# EAGLE design Powerswitch 2 Dioda dan MPU6050 v2  (EAGLE 9.6.2)
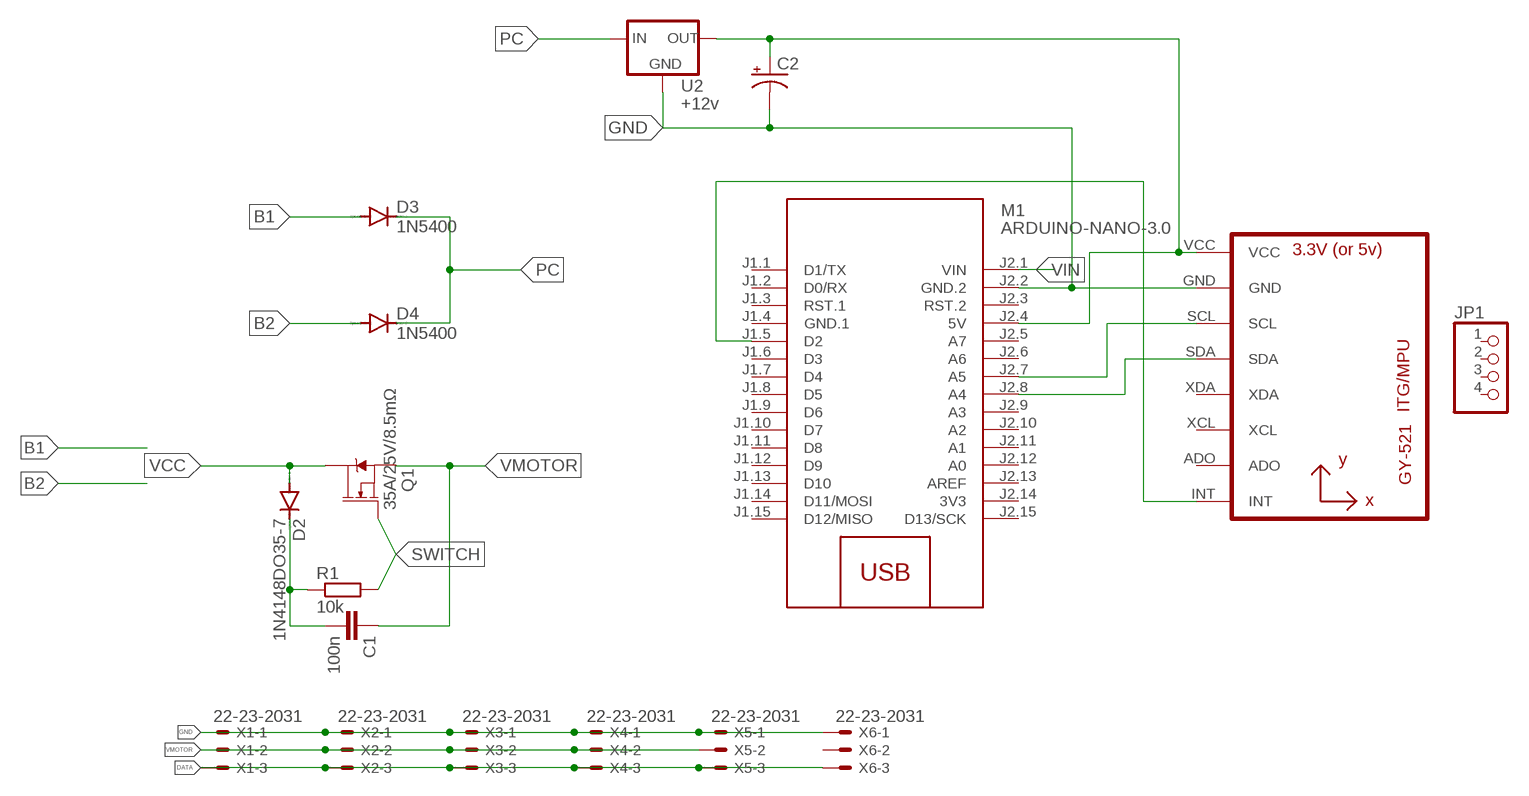
[diagram p0: schematic, sheet 1]

## Parts
C1  100n  C-EU025-030X050  [C025-030X050]
C2  CPOL-USE2-5  [E2-5]
D2  1N4148DO35-7  [DO35-7]
D3  1N5400  [DO201-15]
D4  1N5400  [DO201-15]
JP1  PINHD-1X4  [1X04]
M1  ARDUINO-NANO-3.0  [ARDUINO-NANO-3.0]
Q1  35A/25V/8.5mΩ  MOSFET-NCH-FDD8780  [DPAK]
R1  10k  R-EU_R1206  [R1206]
U1  GY-521MPU6050  [GY-521]
U2  +12v  V_REG_78XX7812  [TO-252]
X1  22-23-2031  [22-23-2031]
X2  22-23-2031  [22-23-2031]
X3  22-23-2031  [22-23-2031]
X4  22-23-2031  [22-23-2031]
X5  22-23-2031  [22-23-2031]
X6  22-23-2031  [22-23-2031]

## Nets
B1: D3.A
B2: D4.A
DATA: X1.3 X2.3 X3.3 X4.3 X5.3 X6.3
GND: C2.- M1.J2.2(GND.2) U1.GND U2.3(GND) X1.1 X2.1 X3.1 X4.1 X5.1 X6.1
N$4: M1.J2.8(A4) U1.SDA
N$5: C1.2 D2.C R1.1
N$6: M1.J2.7(A5) U1.SCL
N$9: M1.J1.5(D2) U1.INT
N$11: C2.+ M1.J2.4(5V) U1.VCC U2.2(OUT)
PC: D3.C D4.C U2.1(IN)
SWITCH: Q1.1(G) R1.2
VCC: D2.A Q1.4(D)
VIN: M1.J2.1(VIN)
VMOTOR: C1.1 Q1.3(S) X1.2 X2.2 X3.2 X4.2 X5.2
Unconnected: JP1.1 JP1.2 JP1.3 JP1.4 M1.J1.1(D1/TX) M1.J1.2(D0/RX) M1.J1.3(RST.1) M1.J1.6(D3) M1.J1.7(D4) M1.J1.8(D5) M1.J1.9(D6) M1.J1.10(D7) M1.J1.11(D8) M1.J1.12(D9) M1.J1.13(D10) M1.J1.14(D11/MOSI) M1.J1.15(D12/MISO) M1.J2.3(RST.2) M1.J2.5(A7) M1.J2.6(A6) M1.J2.9(A3) M1.J2.10(A2) M1.J2.11(A1) M1.J2.12(A0) M1.J2.13(AREF) M1.J2.15(D13/SCK) U1.ADO U1.XCL U1.XDA X6.2

## Power pins joined to a net without a drawn wire
3V3: M1.J2.14(3V3)
GND.1: M1.J1.4(GND.1)

## Library data of the parts
C1 = rcl:C-EU: CAPACITOR, European symbol; SPICEPREFIX: C
C2 = rcl:CPOL-US: POLARIZED CAPACITOR, American symbol; SPICEPREFIX: C
D2 = diode:1N4148: DIODE high speed (Philips)
D3 D4 = diode:1N5400: DIODE standard rectifier, 3 A, 50 V (Motorola)
JP1 = pinhead:PINHD-1X4: PIN HEADER
M1 = diy-modules:ARDUINO-NANO-3.0: Arduino Nano 3.0 and compatible devices More details available here: https://www.arduino.cc/en/Main/ArduinoBoardNano Click here to find device on ebay.com <http://www.ebay.com/sch/arduino+nano>
Q1 = SparkFun-DiscreteSemi:MOSFET-NCH: N-channel MOSFETs Voltage controlled devices that allow control of high current outputs. SparkFun Products: SparkFun OpenScale <https://www.sparkfun.com/products/13261> SparkFun Digital Sandbox <https://www.sparkfun.com/products/12651> SparkFun Monster Moto Shield <https://www.sparkfun.com/products/10182> SparkFun MOSFET Power Controller <https://www.sparkfun.com/products/11214>; PROD_ID: TRANS-09984
R1 = rcl:R-EU_: RESISTOR, European symbol; SPICEPREFIX: R
U1 = gy-521:GY-521
U2 = SparkFun-IC-Power:V_REG_78XX: Voltage Regulator Standard 78xx regulator. IGO (Input Ground Output). Spark Fun Electronics SKU : COM-00107; PROD_ID: VREG-12370
X1-X6 = con-molex:22-23-2031: .100" (2.54mm) Center Header - 3 Pin; MF: MOLEX; MPN: 22-23-2031; OC_FARNELL: 1462950; OC_NEWARK: 30C0862

## Board
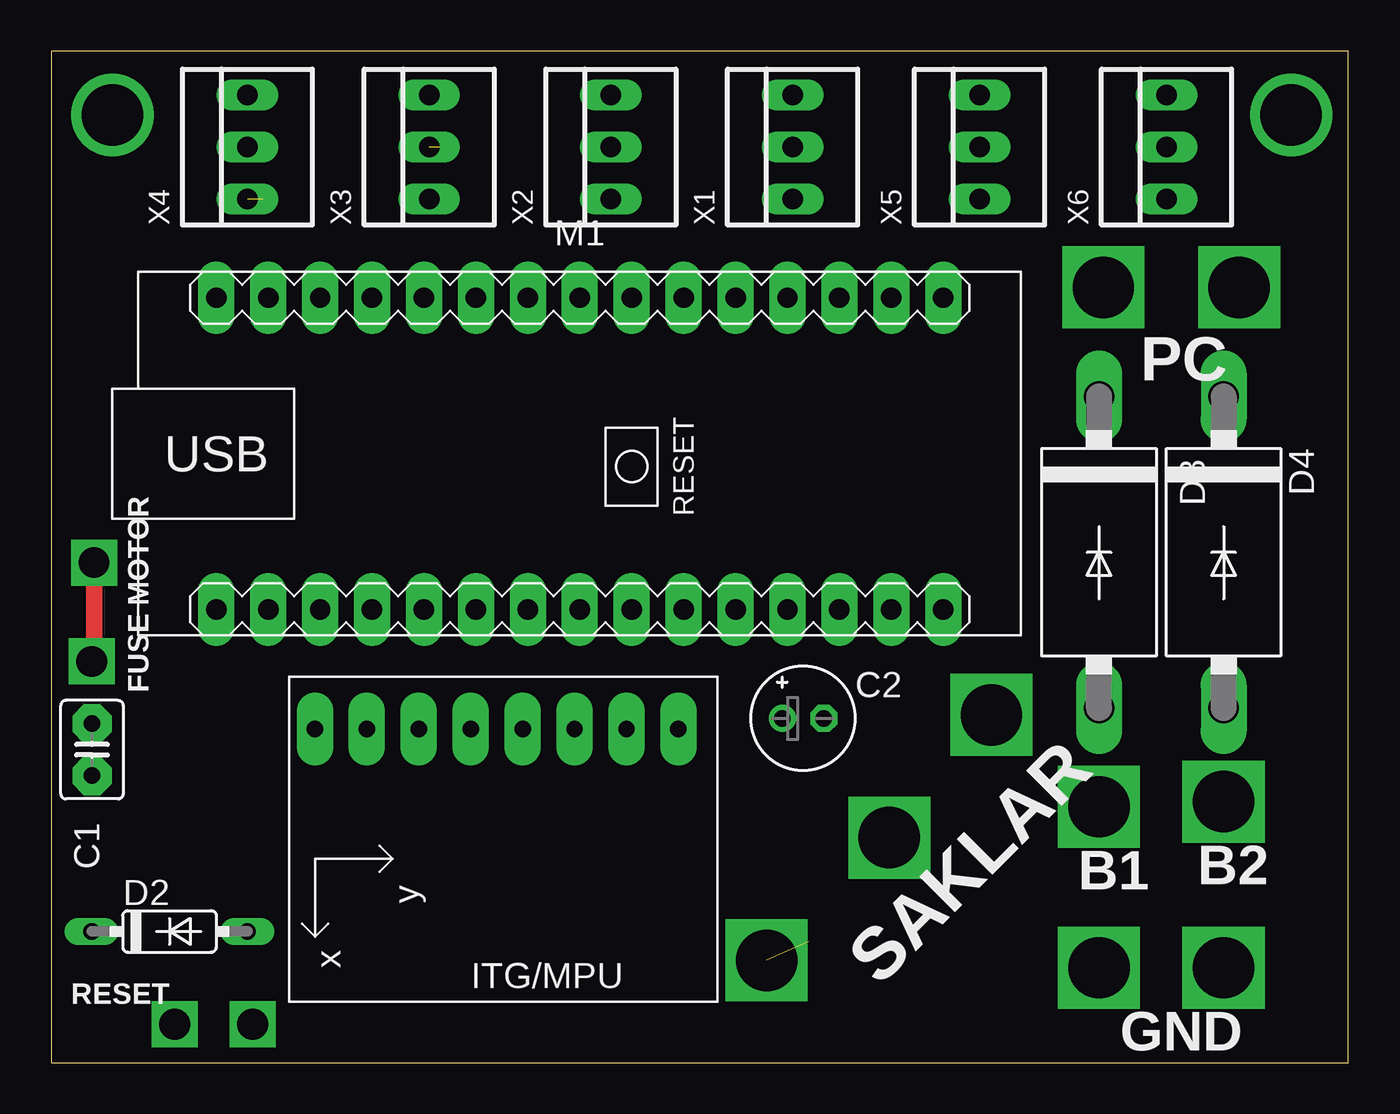
[diagram p1: board, top side]
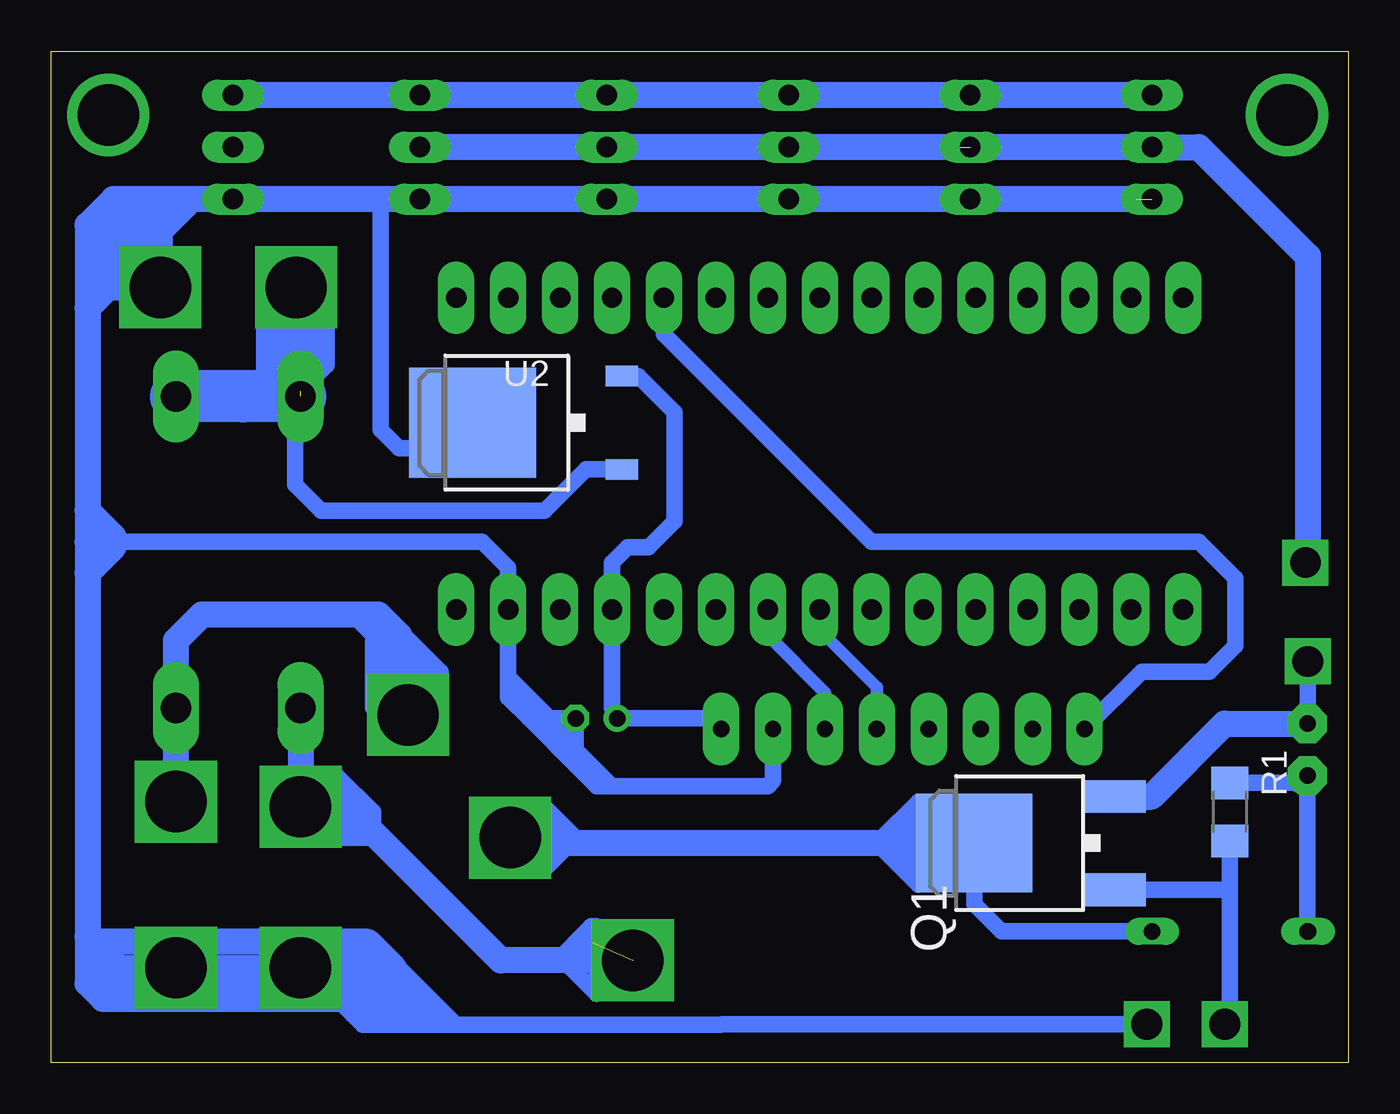
[diagram p2: board, bottom side, seen from below]

Size 63.46 x 49.46 mm. Coordinates in mm from the lower left corner, seen from the top.
Outline: 0,0 63.46,0 63.46,49.46 0,49.46 0,0
Copper layers (1*16): Top 0.035mm / dielectric 1.5mm / Bottom 0.035mm
Design rules "default": minimum track width 6mil, minimum drill 0.35mm, track to track 24mil, track to pad 24mil, pad to pad 24mil, via to via 24mil, smd to smd 24mil, copper to edge 40mil, drill to drill 6mil, minimum pad ring 10mil, minimum via ring 8mil, stop-mask expansion 4mil, vias tented up to drill 0mil, thermal gap 10mil

### Footprints (pad centres in the part's own frame; a part is rotated, then mirrored left to right if it is on the bottom)
C025-030X050 = drill 0.813 pad 1.905 octagon: 1 -1.27,0; 2 1.27,0
E2-5 = drill 0.813 pad 1.27: + -1.016,0 | drill 0.813 pad 1.27 octagon: - 1.016,0
DO35-7 = drill 0.813 long: A 3.81,0; C -3.81,0
DO201-15 = drill 1.499 long: A 7.62,0; C -7.62,0
1X04 = drill 1.016 long: 1 -3.81,0; 2 -1.27,0; 3 1.27,0; 4 3.81,0
ARDUINO-NANO-3.0 = drill 1 pad 1.778 long: J1.1 17.78,7.62; J1.2 15.24,7.62; J1.3 12.7,7.62; J1.4 10.16,7.62; J1.5 7.62,7.62; J1.6 5.08,7.62; J1.7 2.54,7.62; J1.8 0,7.62; J1.9 -2.54,7.62; J1.10 -5.08,7.62; J1.11 -7.62,7.62; J1.12 -10.16,7.62; J1.13 -12.7,7.62; J1.14 -15.24,7.62; J1.15 -17.78,7.62; J2.1 17.78,-7.62; J2.2 15.24,-7.62; J2.3 12.7,-7.62; J2.4 10.16,-7.62; J2.5 7.62,-7.62; J2.6 5.08,-7.62; J2.7 2.54,-7.62; J2.8 0,-7.62; J2.9 -2.54,-7.62; J2.10 -5.08,-7.62; J2.11 -7.62,-7.62; J2.12 -10.16,-7.62; J2.13 -12.7,-7.62; J2.14 -15.24,-7.62; J2.15 -17.78,-7.62
DPAK = smd 1.6 x 3: 1 -2.28,-5.31; 3 2.28,-5.31 | smd 4.826 x 5.715: 4 0,1.588
R1206 = smd 1.6 x 1.803: 1 -1.422,0; 2 1.422,0
GY-521 = drill 0.8 pad 1.778 long: ADO -8.89,-6.35; GND -8.89,6.35; INT -8.89,-8.89; SCL -8.89,3.81; SDA -8.89,1.27; VCC -8.89,8.89; XCL -8.89,-3.81; XDA -8.89,-1.27
TO-252 = smd 1 x 1.6: 1 -2.28,-4.8; 2 2.28,-4.8 | smd 5.4 x 6.2: 3 0,2.5
22-23-2031 = drill 1 long: 1 -2.54,0; 2 0,0; 3 2.54,0

### Placement (x,y rotation side)
C1  2,15.3 270 top
C2  36.78,16.83 0 top
D2  5.79,6.41 0 top
D3  51.26,24.95 270 top
D4  57.36,24.95 270 top
JP1  27.34,-7.05 0 top  (outside the outline)
M1  25.86,29.78 0 top
Q1  16.72,10.73 90 bottom
R1  5.79,12.25 270 bottom
U1  21.8,7.43 270 top
U2  40.34,31.29 90 bottom
X1  36.27,44.77 90 top
X2  27.38,44.77 90 top
X3  18.49,44.77 90 top
X4  9.6,44.77 90 top
X5  45.42,44.77 90 top
X6  54.56,44.77 90 top

### Tracks (layer width: path | path; a pad name or v marks a point on that pad's centre or on a via)
B1  (via drill 3)  (1 unrouted)
  Bottom 0.813: 38.81,4.89 37.04,6.67 36.78,6.67 36.78,3.36 38.31,4.89 | 38.31,4.89 38.56,4.89 | 38.31,4.89 38.05,4.89 37.04,5.9 | 48.21,11.75 49.74,13.27 50.24,13.27 50.24,10.98 47.7,10.98 47.7,12.25 49.48,14.03 51.26,14.03 51.26,11.49 51.01,11.75 48.97,11.75
  Bottom 1.27: D3.A 51.26,14.03 v51.26,12.51 48.97,12.51 48.21,11.75 41.47,5 v35,5
B2  (via drill 3)
  Bottom 0.813: 48.72,21.91 47.7,20.89 46.18,20.89 44.4,19.11 44.4,17.33 47.2,17.33 | 47.2,17.33 47.7,17.33 47.7,20.64 47.45,20.38 46.43,20.38 44.91,18.86 44.91,17.59 45.16,17.59 46.43,18.86 46.43,19.62 45.42,18.6 | 47.2,17.33 47.2,19.87
  Bottom 1.27: v57.36,12.76 D4.A 57.36,20.64 56.09,21.91 48.72,21.91 47.45,21.91 46.43,20.89 46.43,17.43 v46,17
DATA
  Bottom 1.27: X4.3 X3.3 X2.3 X1.3 X5.3 X6.3
GND  (via drill 1.5, 3)  (1 unrouted)
  Bottom 0.813: 41.1,21.14 M1.J2.2 | M1.J2.2 40.97,22.03 40.97,20.99 | 52.02,4.63 v51.26,4.63 | U2.3 41.58,30.03 | 41.58,30.03 46.43,30.03 47.34,30.94 47.34,41.86 47.7,42.23 | 41.1,29.78 41.35,30.03 41.58,30.03 | 40.08,16.83 41.1,17.84 41.1,18.86 | C2.- 38.81,16.83 | 39.07,16.83 40.08,16.83 | 41.1,18.86 M1.J2.2 | U1.GND 28.15,13.78 28.4,13.52 36.02,13.52 | 36.02,13.52 36.78,13.52 37.8,14.54 | v9.86,1.87 30.65,1.87 30.69,1.84 43.64,1.84 | 43.64,1.84 46.43,4.63 | 37.8,14.54 37.8,15.3 | 37.8,15.3 37.8,15.81 | 37.8,15.81 C2.- | 37.8,14.54 38.56,15.3 | 38.56,15.3 38.69,15.43 | 38.81,15.56 40.08,16.83 | 38.81,16.83 38.81,15.56 | 38.81,15.56 38.69,15.43 | C2.- 38.69,15.94 38.69,15.43 | 37.8,15.81 38.31,15.3 38.56,15.3 | 36.02,13.52 37.8,15.3 | 38.81,16.83 39.07,16.83 | 39.07,16.83 41.1,18.86 | M1.J2.2 41.1,24.19 42.37,25.46 61.67,25.46 | 43.64,1.84 48.21,1.84 48.72,2.35 | 49.48,3.11 48.72,2.35 | 48.72,2.35 44.91,2.35 45.42,2.86
  Bottom 1.27: 10.37,42.23 X3.1 X2.1 X1.1 X5.1 47.7,42.23 X6.1 56.59,42.23 | 57.86,40.96 58.12,40.7 v58.12,37.91 60.66,37.91 61.67,36.89 | 57.86,40.96 56.59,42.23 | 61.67,36.89 61.67,26.99 | 61.67,26.99 61.67,25.46 61.67,23.94 | 52.02,4.63 v57.36,4.63 60.15,4.63 61.42,5.9 | 61.67,23.94 61.67,6.16 | 61.67,6.16 61.42,5.9 | v51.26,4.63 46.69,4.63 47.96,5.9 61.42,5.9 | 56.59,42.23 60.4,42.23 61.67,40.96 61.67,36.89 | 57.86,40.96 60.15,40.96 60.66,40.45 60.66,40.19 | 60.66,40.19 60.66,38.16 | 60.66,40.19 60.4,39.94 58.88,39.94 59.13,39.69 59.13,38.92 59.9,38.92 | 61.67,26.99 60.4,25.72 60.4,25.21 61.67,23.94 | 61.67,6.16 61.67,3.87 60.91,3.11 49.48,3.11 45.93,3.11 46.69,3.87 60.4,3.87 61.17,4.63 61.17,4.89
N$1  (via drill 3 pad 3.1)
  other vias: 3,46.34
N$2  (via drill 3 pad 3.1)
  other vias: 60.66,46.34
N$4
  Bottom 0.61: U1.SDA 23.07,18.35 25.86,21.14 M1.J2.8
N$5
  Bottom 0.813: R1.1 2.68,13.68 2,13.35 C1.2 2,6.43 D2.C
N$6
  Bottom 0.61: M1.J2.7 28.4,20.89 25.61,18.1 U1.SCL
N$9
  Bottom 0.813: U1.INT 10.11,19.11 6.81,19.11 5.54,20.38 5.54,23.68 7.32,25.46 23.32,25.46 33.48,35.62 M1.J1.5
N$11
  Bottom 0.61: 36.02,21.91 M1.J2.4
  Bottom 0.813: M1.J2.4 36.02,20.89 | U1.VCC 31.19,16.83 C2.+ 35.51,16.83 | U2.2 34.73,33.57 32.97,31.81 32.97,26.48 34.24,25.21 35.26,25.21 36.02,24.45 M1.J2.4 | M1.J2.4 36.02,17.33 35.51,16.83 | 35.51,16.83 35.48,16.83
PC  (via drill 3)  (1 unrouted)
  Bottom 0.813: 55.29,32.57 D4.C | U2.1 37.3,29.01 39.32,26.99 50.24,26.99 51.51,28.26 51.51,32.32 D3.C 51.48,32.79 | 51.26,32.83 49.99,34.1 49.99,36.64 53.04,36.64 53.04,33.84 52.28,33.08
  Bottom 2.54: D3.C D4.C 54.05,32.57 | v51.48,37.91 51.48,32.79
SWITCH  (via drill 1.5)
  Bottom 0.813: Q1.1 5.79,8.45 | 5.79,8.45 R1.2 | 5.79,8.45 5.79,2.13 v6.05,1.87
VCC  (via drill 3)
  Bottom 0.813: D2.A 16.97,6.41 18.3,7.75 Q1.4 | 40.73,10.73 v41,11 | 23.07,10.73 21.03,8.7 21.03,12.76 22.81,10.98 22.81,10.73 22.3,10.73 21.54,11.49 21.54,9.97 | 37.54,10.73 39.32,12.51 39.83,12.51 39.83,9.46 39.32,9.46 38.05,10.73 38.81,11.49 39.07,11.49
  Bottom 1.27: Q1.4 22.81,10.73 23.07,10.73 37.54,10.73 38.05,10.73 40.73,10.73
VMOTOR  (via drill 1.5)  (1 unrouted)
  Top 0.813: v2.1,24.45 2.1,19.73 v1.98,19.62
  Bottom 0.813: 1.98,24.95 1.98,24.56 v2.1,24.45 | v1.98,19.62 1.98,16.59 C1.1
  Bottom 1.27: 19,44.77 X4.2 7.32,44.77 1.98,39.43 1.98,24.95 | X3.2 X2.2 X1.2 X5.2 | Q1.3 9.63,13.01 6.06,16.57 C1.1

### Text on the board
tNames: PC | FUSE MOTOR | B2 | B1 | SAKLAR | RESET | GND